# Altium schematic sheet ADA4817.SchDoc
size A3; SheetNumber: 16; SheetTotal: 33
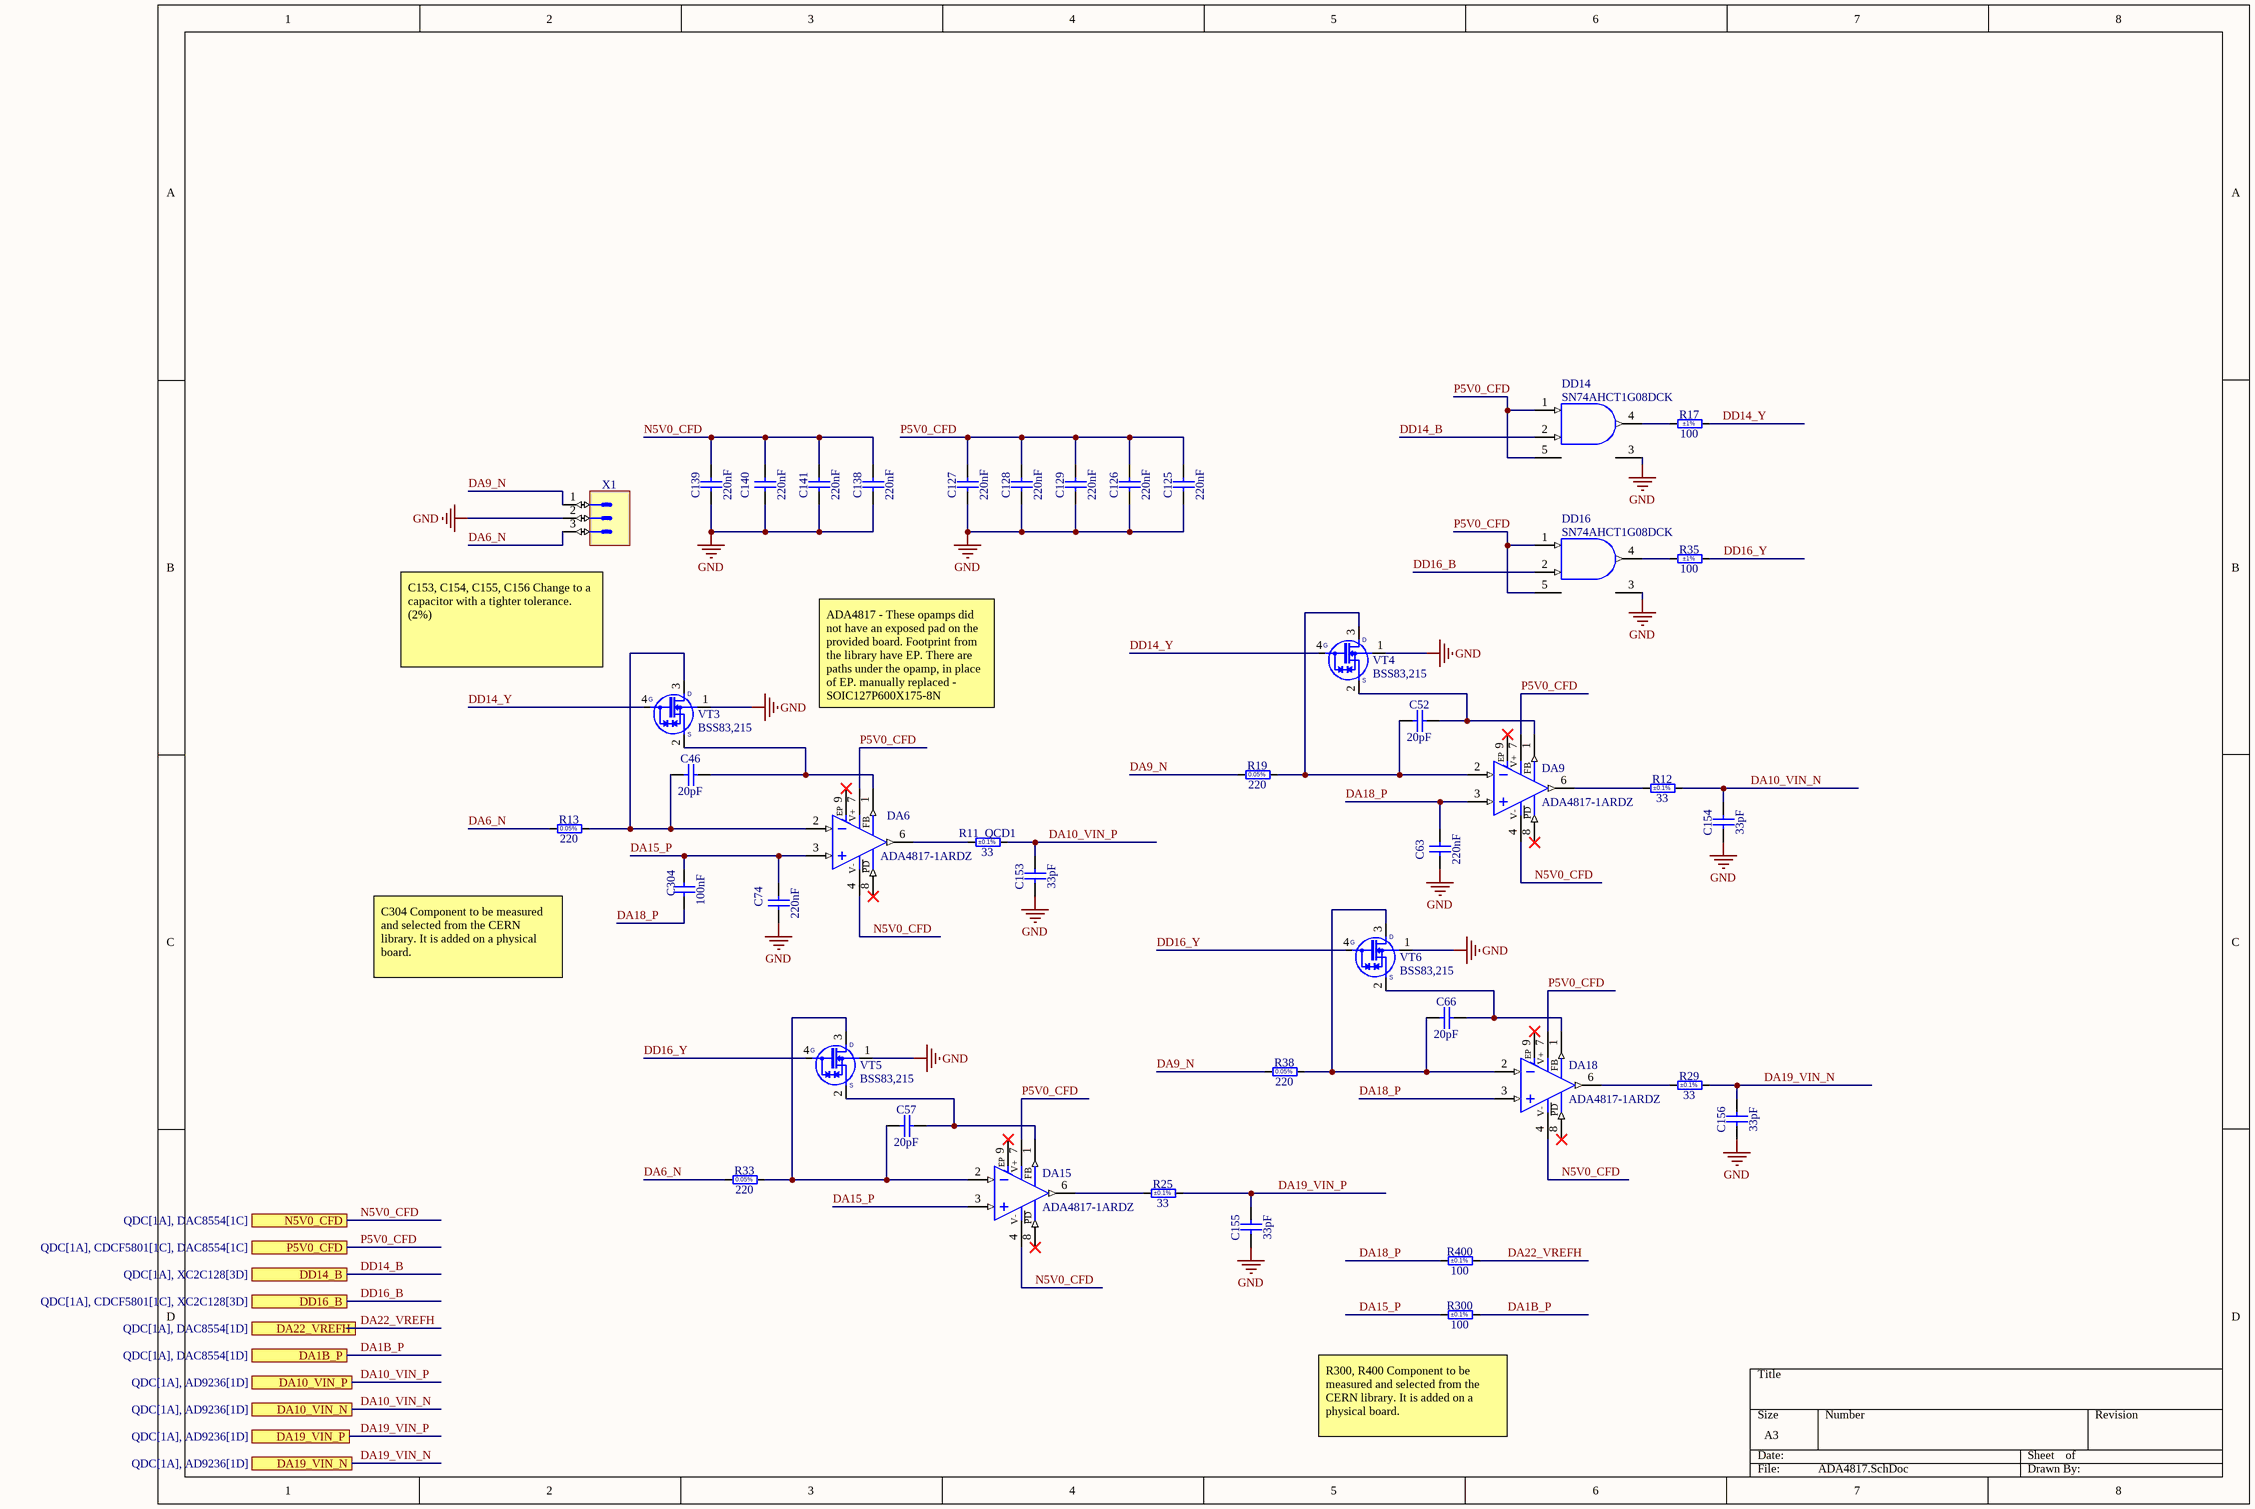
[diagram p0: ADA4817.SchDoc]

## Parts
C46  20pF  [CAPC2012X135N]
C52  20pF  [CAPC2012X135N]
C57  20pF  [CAPC2012X135N]
C63  220nF  [CAPC2012X135N]
C66  20pF  [CAPC2012X135N]
C74  220nF  [CAPC2012X135N]
C125  220nF  [CAPC2012X135N]
C126  220nF  [CAPC2012X135N]
C127  220nF  [CAPC2012X135N]
C128  220nF  [CAPC2012X135N]
C129  220nF  [CAPC2012X135N]
C138  220nF  [CAPC2012X135N]
C139  220nF  [CAPC2012X135N]
C140  220nF  [CAPC2012X135N]
C141  220nF  [CAPC2012X135N]
C153  33pF  [CAPC1608X87N]
C154  33pF  [CAPC1608X87N]
C155  33pF  [CAPC1608X87N]
C156  33pF  [CAPC1608X87N]
C304  100nF  [CAPC2012X88N]
DA6  ADA4817-1ARDZ  [SOIC127P600X175-8N]
DA9  ADA4817-1ARDZ  [SOIC127P600X175-8N]
DA15  ADA4817-1ARDZ  [SOIC127P600X175-8N]
DA18  ADA4817-1ARDZ  [SOIC127P600X175-8N]
DD14  SN74AHCT1G08DCK  [SOT65P210X110-5N]
DD16  SN74AHCT1G08DCK  [SOT65P210X110-5N]
R11_QCD1  33  Tolerance: ±0.1%  [RESC1608X64N]
R12  33  Tolerance: ±0.1%  [RESC1608X64N]
R13  220  [RESC2012X60N]
R17  100  Tolerance: ±1%  [RESC1608X55N]
R19  220  [RESC2012X60N]
R25  33  Tolerance: ±0.1%  [RESC1608X64N]
R29  33  Tolerance: ±0.1%  [RESC1608X64N]
R33  220  [RESC2012X60N]
R35  100  Tolerance: ±1%  [RESC1608X55N]
R38  220  [RESC2012X60N]
R300  100  Tolerance: ±0.1%  [RES_VISHAY_FCHP0402]
R400  100  Tolerance: ±0.1%  [RES_VISHAY_FCHP0402]
VT3  BSS83,215  [SOT143N]
VT4  BSS83,215  [SOT143N]
VT5  BSS83,215  [SOT143N]
VT6  BSS83,215  [SOT143N]
X1  Header 3  [SAMTEC_DW-03-09-L-S-470]  (value not drawn)

## Ports
DA1B_P (see QDC[1A], DAC8554[1D]), DA10_VIN_N (see QDC[1A], AD9236[1D]), DA10_VIN_P (see QDC[1A], AD9236[1D]), DA19_VIN_N (see QDC[1A], AD9236[1D]), DA19_VIN_P (see QDC[1A], AD9236[1D]), DA22_VREFH (see QDC[1A], DAC8554[1D]), DD14_B (see QDC[1A], XC2C128[3D]), DD16_B (see QDC[1A], CDCF5801[1C], XC2C128[3D]), N5V0_CFD (see QDC[1A], DAC8554[1C]), P5V0_CFD (see QDC[1A], CDCF5801[1C], DAC8554[1C])

## Nets
GND: C63.1 C74.1 C125.1 C126.1 C127.1 C128.1 C129.1 C138.1 C139.1 C140.1 C141.1 C153.1 C154.1 C155.1 C156.1 DD14.3(GND) DD16.3(GND) VT3.1(SUB) VT4.1(SUB) VT5.1(SUB) VT6.1(SUB) X1.2
DA1B_P: R300.2 ; port DA1B_P
DA6_N: R13.1 R33.1 X1.3
DA9_N: R19.1 R38.1 X1.1
DA10_VIN_N: C154.2 R12.2 ; port DA10_VIN_N
DA10_VIN_P: C153.2 R11_QCD1.2 ; port DA10_VIN_P
DA15_P: C74.2 C304.2 DA6.3(IN+) DA15.3(IN+) R300.1
DA18_P: C63.2 C304.1 DA9.3(IN+) DA18.3(IN+) R400.1
DA19_VIN_N: C156.2 R29.2 ; port DA19_VIN_N
DA19_VIN_P: C155.2 R25.2 ; port DA19_VIN_P
DA22_VREFH: R400.2 ; port DA22_VREFH
DD14_B: DD14.2(A) ; port DD14_B
DD14_Y: R17.2 VT3.4(G) VT4.4(G)
DD16_B: DD16.2(A) ; port DD16_B
DD16_Y: R35.2 VT5.4(G) VT6.4(G)
N5V0_CFD: C138.2 C139.2 C140.2 C141.2 DA6.4(-Vs) DA9.4(-Vs) DA15.4(-Vs) DA18.4(-Vs) ; port N5V0_CFD
P5V0_CFD: C125.2 C126.2 C127.2 C128.2 C129.2 DA6.7(+Vs) DA9.7(+Vs) DA15.7(+Vs) DA18.7(+Vs) DD14.1(B) DD14.5(VCC) DD16.1(B) DD16.5(VCC) ; port P5V0_CFD
NetC46_1: C46.1 DA6.2(IN-) R13.2 VT3.3(D)
NetC46_2: C46.2 DA6.1(FB) VT3.2(S)
NetC52_1: C52.1 DA9.2(IN-) R19.2 VT4.3(D)
NetC52_2: C52.2 DA9.1(FB) VT4.2(S)
NetC57_1: C57.1 DA15.2(IN-) R33.2 VT5.3(D)
NetC57_2: C57.2 DA15.1(FB) VT5.2(S)
NetC66_1: C66.1 DA18.2(IN-) R38.2 VT6.3(D)
NetC66_2: C66.2 DA18.1(FB) VT6.2(S)
NetDA6_6: DA6.6(OUT) R11_QCD1.1
NetDA9_6: DA9.6(OUT) R12.1
NetDA15_6: DA15.6(OUT) R25.1
NetDA18_6: DA18.6(OUT) R29.1
NetDD14_4: DD14.4(Y) R17.1
NetDD16_4: DD16.4(Y) R35.1

Not connected (* = marked no-connect by the designer): DA6 8(~{PD})* 9(EP)*; DA9 8(~{PD})* 9(EP)*; DA15 8(~{PD})* 9(EP)*; DA18 8(~{PD})* 9(EP)*

## Notes on the sheet
- C153, C154, C155, C156 Change to a capacitor with a tighter tolerance. (2%)
- ADA4817 - These opamps did not have an exposed pad on the provided board. Footprint from the library have EP. There are paths under the opamp, in place of EP. manually replaced - SOIC127P600X175-8N
- C304 Component to be measured and selected from the CERN library. It is added on a physical board.
- (near R300) R300, R400 Component to be measured and selected from the CERN library. It is added on a physical board.
- (in symbol ADA4817-1ARDZ) V+; PD; V-
- (in symbol R0805_220R_0.05%_0.125W_10PPM) 0.05%

## Library data of the parts
C46 C52 C57 C66 = CC0805_20PF_50V_2%_C0G: Non-polarised capacitor; Part Description: SMD Multilayer Chip Ceramic Capacitor; Manufacturer: GENERIC; Manufacturer1 Part Number: CC0805GRNPO9BN200; Voltage: 50V; TC: C0G/NP0; Tolerance: ±2%; Part Number: CC0805_20PF_50V_2%_C0G; Component Kind: Standard; Component Type: Standard; Pin Count: 2; Value: 20pF; Status: None; Manufacturer Part Number: CC0805_20PF_50V_2%_C0G; Case: 0805; Mounted: Yes; Socket: No; SMD: Yes; Sense: No; Manufacturer1 Example: YAGEO PHYCOMP; Manufacturer1 ComponentHeight: 1.45mm; HelpURL: \\cern.ch\dfs\Applications\Altium\Datasheets\CC0805_NP0_YAGEO.pdf; Author: CERN DEM HF; CreateDate: 07.05.2024; LatestRevisionDate: 07.05.2024
C63 C74 C125-C129 C138-C141 = CC0805_220NF_50V_10%_X7R: Non-polarised capacitor; Part Description: SMD Multilayer Chip Ceramic Capacitor; Manufacturer: GENERIC; Manufacturer1 Part Number: GRM21BR71H224KA01L; Voltage: 50V; TC: X7R; Tolerance: ±10%; Part Number: CC0805_220NF_50V_10%_X7R; Component Kind: Standard; Component Type: Standard; Pin Count: 2; Value: 220nF; Status: Preferred; Manufacturer Part Number: CC0805_220NF_50V_10%_X7R; Case: 0805; Mounted: Yes; Socket: No; SMD: Yes; Sense: No; Manufacturer1 Example: MURATA; Manufacturer1 ComponentHeight: 1.35mm; HelpURL: \\cern.ch\dfs\Applications\Altium\Datasheets\CC0805_X7R_MURATA.pdf; Author: CERN DEM JLC; CreateDate: 03.12.2007; LatestRevisionDate: 03.12.2007
C153-C156 = CC0603_33PF_50V_5%_NP0: Non-polarised capacitor; Part Description: SMD Multilayer Chip Ceramic Capacitor; Manufacturer: GENERIC; Manufacturer1 Part Number: 223886715339; Voltage: 50V; TC: C0G/NP0; Tolerance: ±5%; Part Number: CC0603_33PF_50V_5%_NP0; Component Kind: Standard; Component Type: Standard; Pin Count: 2; Value: 33pF; Status: Preferred; Manufacturer Part Number: CC0603_33PF_50V_5%_NP0; Case: 0603; Mounted: Yes; Socket: No; SMD: Yes; Sense: No; Manufacturer1 Example: PHYCOMP; Manufacturer1 ComponentHeight: 0.87mm; HelpURL: \\cern.ch\dfs\Applications\Altium\Datasheets\CC0603_NP0_PHYCOMP.pdf; Author: CERN DEM JLC; CreateDate: 03.12.2007; LatestRevisionDate: 03.12.2007
C304 = CC0805_100NF_50V_1%_NP0: Non-polarised capacitor; Part Description: SMD Multilayer Chip Ceramic Capacitor; Manufacturer: GENERIC; Manufacturer1 Part Number: 0805N103F500C; Voltage: 50V; TC: C0G/NP0; Tolerance: ±1%; Part Number: CC0805_100NF_50V_1%_NP0; Component Kind: Standard; Component Type: Standard; Footprint: CAPC2012X135N; Pin Count: 2; Value: 100nF; Status: Not Recommended; Manufacturer Part Number: CC0805_100NF_50V_1%_NP0; Case: 0805; Mounted: Yes; Socket: No; SMD: Yes; Sense: No; ComponentHeight: 1.35mm; Manufacturer1 Example: WALSIN TECHNOLOGY CORPORATION; Manufacturer1 ComponentHeight: 1.35mm; HelpURL: \\cern.ch\dfs\Applications\Altium\Datasheets\CC0805_WALSIN_0805.pdf; Author: CERN DEM HF; CreateDate: 28.08.2023; LatestRevisionDate: 28.08.2023
DA6 DA9 DA15 DA18 = ADA4817-1ARDZ: Low Noise, 1GHz FastFEET Operational Amplifier; Part Description: Low Noise, 1GHz FastFET Operational Amplifier; Manufacturer: ANALOG DEVICES; PressFit: No; Bonding: No; Part Number: ADA4817-1ARDZ; Component Kind: Standard; Component Type: Standard; Device: ADA4817-1ARDZ; Footprint: SOIC127P600X175-9N-S229; PackageDescription: SOIC, 1.27mm Pitch; 8 Pin, 3.90mm W X 4.90mm L X 1.75mm H body (w/Thermal Tab 2.29 X 2.29mm), IPC Medium Density; Manufacturer Part Number: ADA4817-1ARD; Pin Count: 9; Case: SOIC8; Mounted: Yes; Socket: No; SMD: Yes; Sense: No; ComponentHeight: 1.75mm; Author: CERN DEM JLC; HelpURL: \\cern.ch\dfs\Applications\Altium\Datasheets\ADA4817-1ARDZ.pdf; CreateDate: 20.09.2017; LatestRevisionDate: 31.03.2022
DD14 DD16 = SN74AHCT1G08DCK: Single 2-Input AND Gate; Part Description: Single 2-Input Positive-AND Gate; Manufacturer: TEXAS INSTRUMENTS; PressFit: No; Bonding: No; Part Number: SN74AHCT1G08DCK; Component Kind: Standard; Component Type: Standard; Device: SN74AHCT1G08DCK; PackageDescription: SOT353, SC70-5, 0.65mm Pitch; 5 Pin, 1.25mm W X 2.00mm L X 1.10mm H body, IPC Medium Density; Manufacturer Part Number: SN74AHCT1G08DCK; Pin Count: 5; Case: SOT353; Mounted: Yes; Socket: No; SMD: Yes; Sense: No; ComponentHeight: 1.1mm; Author: CERN DEM HF; HelpURL: \\cern.ch\dfs\Applications\Altium\Datasheets\NC7SZ08.pdf; CreateDate: 17.05.2024; LatestRevisionDate: 17.05.2024
R11_QCD1 R12 R25 R29 = R0603_33R_0.1%_0.1W_10PPM: Resistor - 0.1%; Part Description: Thin Film Chip Resistor; Manufacturer: GENERIC; Manufacturer1 Part Number: RT0603BRD0733RL; Power: 0.1W; TC: ±10ppm/°C; PressFit: No; Part Number: R0603_33R_0.1%_0.1W_10PPM; Component Kind: Standard; Component Type: Standard; Pin Count: 2; Value: 33; Status: Not Recommended; Manufacturer Part Number: R0603_33R_0.1%_0.1W_10PPM; Case: 0603; Mounted: Yes; Sense: No; Socket: No; SMD: Yes; Manufacturer1 Example: YAGEO; Manufacturer1 ComponentHeight: 0.55mm; HelpURL: \\cern.ch\dfs\Applications\Altium\Datasheets\R0603_YAGEO_RT.pdf; Author: CERN DEM HF; CreateDate: 17.05.2024; LatestRevisionDate: 17.05.2024
R13 R19 R33 R38 = R0805_220R_0.05%_0.125W_10PPM: Resistor - 0.05%; Part Description: Thin Film Chip Resistor; Manufacturer: GENERIC; Manufacturer1 Part Number: RG2012N-221-W-T1; Power: 0.125W; TC: ±10ppm/°C; PressFit: No; Part Number: R0805_220R_0.05%_0.125W_10PPM; Component Kind: Standard; Component Type: Standard; Pin Count: 2; Value: 220; Status: Not Recommended; Tolerance: ±0.05%; Manufacturer Part Number: R0805_220R_0.05%_0.125W_10PPM; Case: 0805; Mounted: Yes; Sense: No; Socket: No; SMD: Yes; Manufacturer1 Example: SUSUMU; Manufacturer1 ComponentHeight: 0.5mm; HelpURL: \\cern.ch\dfs\Applications\Altium\Datasheets\R0805_SUSUMU_RG.pdf; Author: CERN DEM HF; CreateDate: 17.05.2024; LatestRevisionDate: 17.05.2024
R17 R35 = R0603_100R_1%_0.1W_100PPM: Resistor - 1%; Part Description: General Purpose Thick Film Chip Resistor; Manufacturer: GENERIC; Manufacturer1 Part Number: NRC06F4700TRF; Power: 0.1W; TC: ±100ppm/°C; PressFit: No; Part Number: R0603_100R_1%_0.1W_100PPM; Component Kind: Standard; Component Type: Standard; Pin Count: 2; Value: 100; Status: Preferred; Manufacturer Part Number: R0603_100R_1%_0.1W_100PPM; Case: 0603; Mounted: Yes; Sense: No; Socket: No; SMD: Yes; Manufacturer1 Example: NIC COMPONENT; Manufacturer1 ComponentHeight: 0.55mm; HelpURL: \\cern.ch\dfs\Applications\Altium\Datasheets\R0603_NIC_NRC.pdf; Author: CERN DEM JLC; CreateDate: 03.12.2007; LatestRevisionDate: 13.03.2008
R300 R400 = R0402_100R_0.1%_1W_25PPM_VISHAY_FCHP0402E1000BS: Resistor - 0.1%; Part Description: High Frequency 60 GHz High Power 1 W Thin Film Surface Mount Chip Resistor; Manufacturer: VISHAY; Power: 1W; TC: ±25ppm/°C; PressFit: No; Part Number: R0402_100R_0.1%_1W_25PPM_VISHAY_FCHP0402E1000BS; Component Kind: Standard; Component Type: Standard; Pin Count: 2; Value: 100; Status: Not Recommended; Manufacturer Part Number: FCHP0402E1000BS; Case: 0402; Mounted: Yes; Sense: No; Socket: No; SMD: Yes; ComponentHeight: 0.38mm; HelpURL: \\cern.ch\dfs\Applications\Altium\Datasheets\R0402_VISHAY_FCHP.pdf; Author: CERN DEM HF; CreateDate: 04.04.2023; LatestRevisionDate: 04.04.2023
VT3-VT6 = BSS83,215: 10V, 50 mA N-Channel Enhancement Switching Transistor; Part Description: 10V, 50mA, N-Channel Enhancement Switching Transistor; Manufacturer: NXP SEMICONDUCTORS; PressFit: No; Bonding: No; Part Number: BSS83,215; Component Kind: Standard; Component Type: Standard; Device: BSS83,215; PackageDescription: SOT143, 4-Leads, Body 3.0x2.6mm (max), Pitch 1.92mm, IPC Medium Density; Status: Obsolete; Manufacturer Part Number: BSS83,215; Pin Count: 4; Case: SOT143; Mounted: Yes; Socket: No; SMD: Yes; Sense: No; ComponentHeight: 1.3mm; HelpURL: \\cern.ch\dfs\Applications\Altium\Datasheets\BSS83,215.pdf; Author: CERN DEM JLC; CreateDate: 01.07.2014; LatestRevisionDate: 17.05.2016
X1 = SAMTEC_DW-03-09-L-S-470: Connector 3 Male; Part Description: 3 Contacts, Pitch 2.54mm, Single Row Straight .Flex Stack, Flexible Board Stacker (Stacker Height = 11,938mm); Manufacturer: SAMTEC; PressFit: No; Part Number: SAMTEC_DW-03-09-L-S-470; Component Kind: Standard; Component Type: Standard; Pin Count: 3; Family: Header 3; Mounted: Yes; Socket: No; SMD: No; Sense: No; Status: None; Manufacturer Part Number: DW-03-09-L-S-470; ComponentHeight: 15.75mm; HelpURL: \\cern.ch\dfs\Applications\Altium\Datasheets\SAMTEC_DW.pdf; Author: CERN DEM HF; CreateDate: 06.06.2024; LatestRevisionDate: 06.06.2024